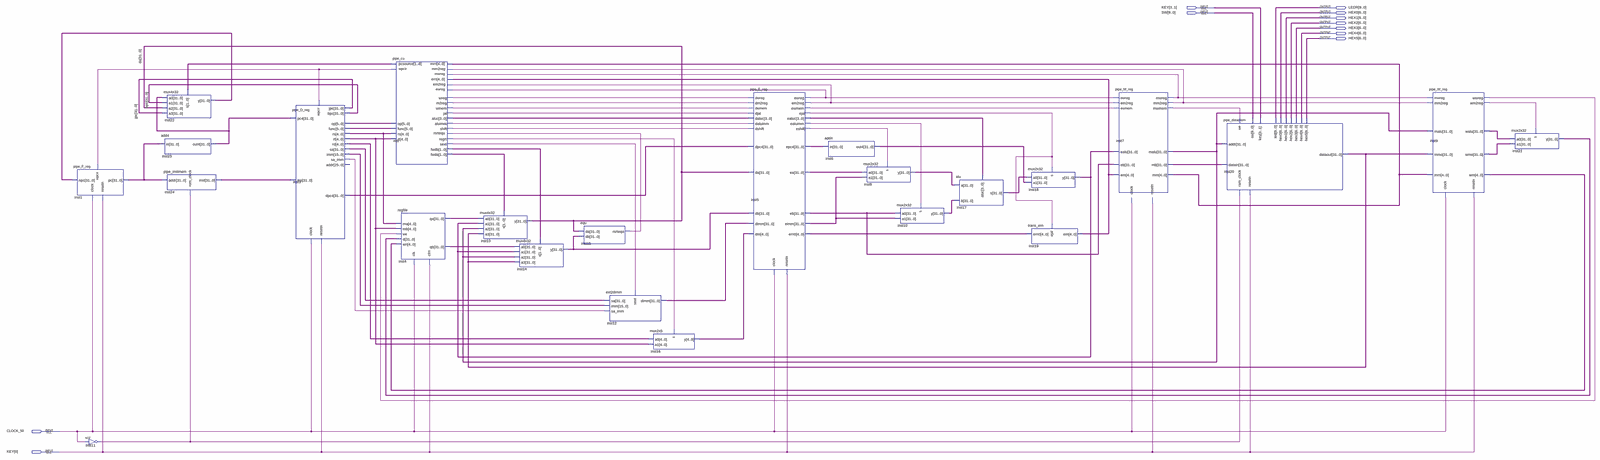
[diagram p0: schematic sheet, whole]
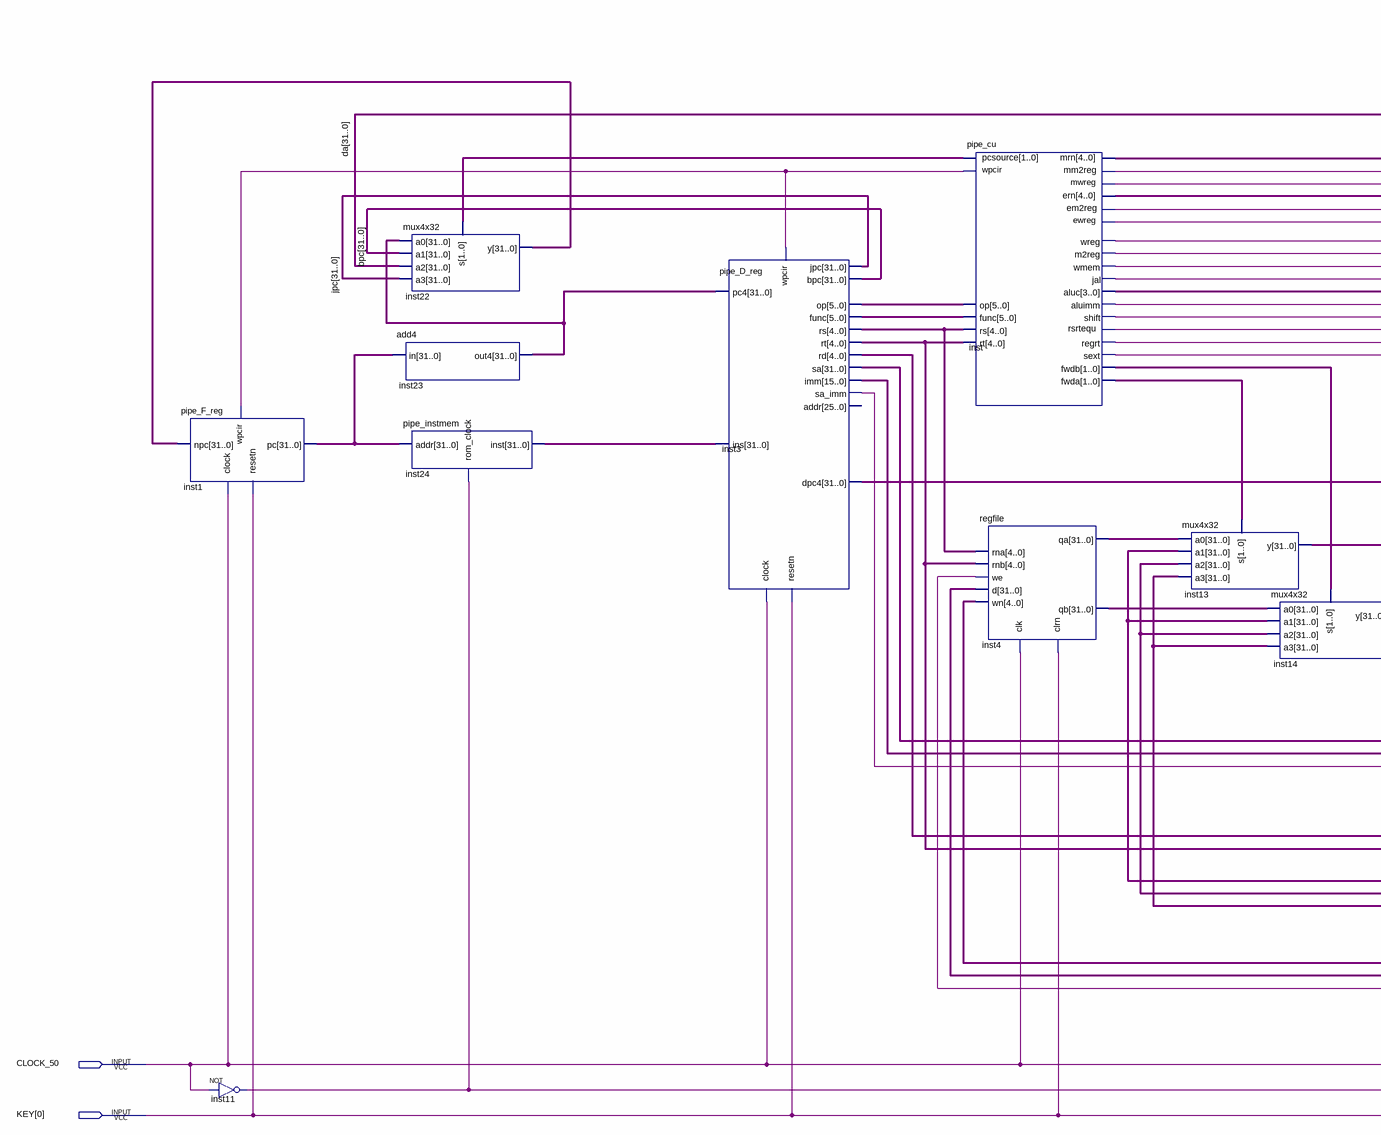
[diagram p1: schematic sheet, left part]
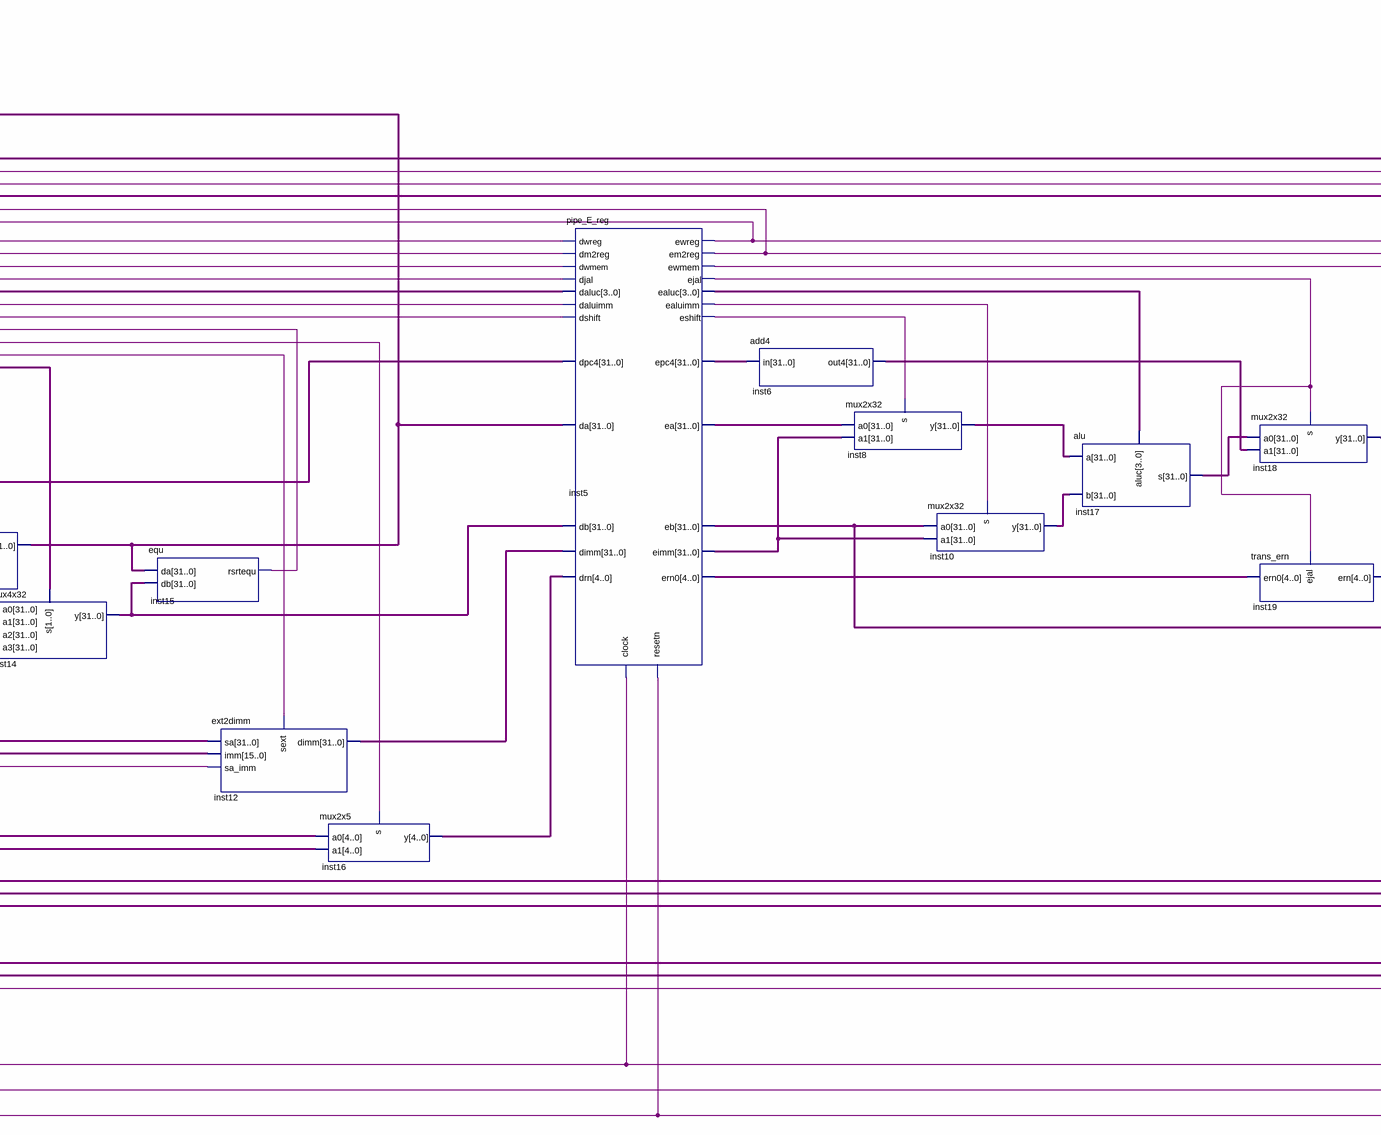
[diagram p2: schematic sheet, centre part]
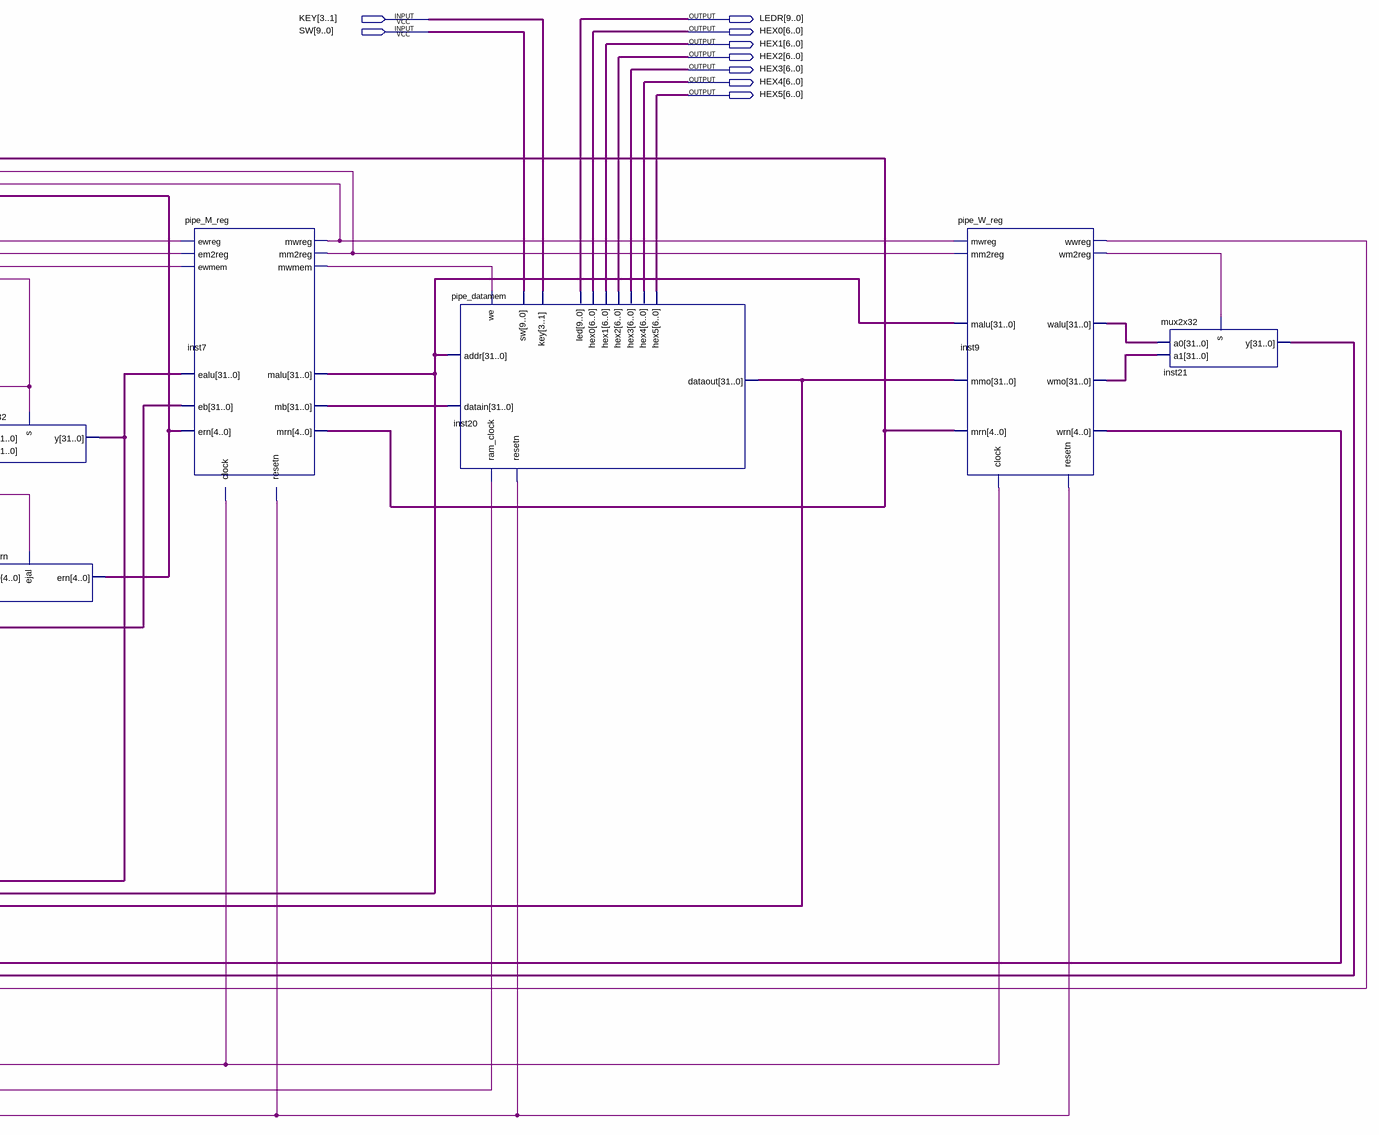
[diagram p3: schematic sheet, right part]
// Quartus schematic pipe_computer.bdf as structural Verilog: 24 symbols, 11 pins
module pipe_computer (
  input  [3:0] KEY,
  input  [9:0] SW,
  input  CLOCK_50,
  output [9:0] LEDR,
  output [6:0] HEX0,
  output [6:0] HEX1,
  output [6:0] HEX2,
  output [6:0] HEX3,
  output [6:0] HEX4,
  output [6:0] HEX5
);

  wire inst3_sa_imm, inst5_ealuimm, inst5_ejal, inst5_em2reg, inst5_eshift, inst5_ewmem, inst5_ewreg,
       inst7_mm2reg, inst7_mwmem, inst7_mwreg, inst9_wm2reg, inst9_wwreg, inst11_out, inst15_rsrtequ,
       inst_aluimm, inst_jal, inst_m2reg, inst_regrt, inst_sext, inst_shift, inst_wmem, inst_wpcir, inst_wreg;
  wire [1:0] inst_fwda, inst_fwdb, inst_pcsource;
  wire [3:0] inst5_ealuc, inst_aluc;
  wire [4:0] inst3_rd, inst3_rs, inst3_rt, inst5_ern0, inst7_mrn, inst9_wrn, inst16_y, inst19_ern;
  wire [5:0] inst3_func, inst3_op;
  wire [15:0] inst3_imm;
  wire [31:0] bpc, da, inst1_pc, inst3_dpc4, inst3_sa, inst4_qa, inst4_qb, inst5_ea, inst5_eb, inst5_eimm,
       inst5_epc4, inst6_out4, inst7_malu, inst7_mb, inst8_y, inst9_walu, inst9_wmo, inst10_y, inst12_dimm,
       inst14_y, inst17_s, inst18_y, inst20_dataout, inst21_y, inst22_y, inst23_out4, inst24_inst, jpc;

  pipe_F_reg inst1 (.npc(inst22_y), .wpcir(inst_wpcir), .clock(CLOCK_50), .resetn(KEY[0]), .pc(inst1_pc));
  not inst11 (inst11_out, CLOCK_50);
  mux4x32 inst22 (.a0(inst23_out4), .a1(bpc), .a2(da), .a3(jpc), .s(inst_pcsource), .y(inst22_y));
  add4 inst23 (.in(inst1_pc), .out4(inst23_out4));
  pipe_instmem inst24 (.addr(inst1_pc), .rom_clock(inst11_out), .inst(inst24_inst));
  pipe_D_reg inst3 (
    .pc4(inst23_out4), .ins(inst24_inst), .wpcir(inst_wpcir), .clock(CLOCK_50), .resetn(KEY[0]),
    .dpc4(inst3_dpc4), .op(inst3_op), .func(inst3_func), .rs(inst3_rs), .rt(inst3_rt), .rd(inst3_rd),
    .sa(inst3_sa), .imm(inst3_imm), .sa_imm(inst3_sa_imm), .jpc(jpc), .bpc(bpc));  // open: addr
  pipe_cu inst (
    .op(inst3_op), .func(inst3_func), .rs(inst3_rs), .rt(inst3_rt), .ern(inst19_ern), .mrn(inst7_mrn),
    .rsrtequ(inst15_rsrtequ), .ewreg(inst5_ewreg), .em2reg(inst5_em2reg), .mwreg(inst7_mwreg),
    .mm2reg(inst7_mm2reg), .wpcir(inst_wpcir), .wreg(inst_wreg), .m2reg(inst_m2reg), .wmem(inst_wmem),
    .jal(inst_jal), .aluimm(inst_aluimm), .shift(inst_shift), .regrt(inst_regrt), .sext(inst_sext),
    .pcsource(inst_pcsource), .fwda(inst_fwda), .fwdb(inst_fwdb), .aluc(inst_aluc));
  regfile inst4 (
    .rna(inst3_rs), .rnb(inst3_rt), .d(inst21_y), .wn(inst9_wrn), .we(inst9_wwreg), .clk(CLOCK_50),
    .clrn(KEY[0]), .qa(inst4_qa), .qb(inst4_qb));
  mux4x32 inst13 (.a0(inst4_qa), .a1(inst18_y), .a2(inst7_malu), .a3(inst20_dataout), .s(inst_fwda), .y(da));
  mux4x32 inst14 (.a0(inst4_qb), .a1(inst18_y), .a2(inst7_malu), .a3(inst20_dataout), .s(inst_fwdb), .y(inst14_y));
  equ inst15 (.da(da), .db(inst14_y), .rsrtequ(inst15_rsrtequ));
  ext2dimm inst12 (.sa(inst3_sa), .imm(inst3_imm), .sa_imm(inst3_sa_imm), .sext(inst_sext), .dimm(inst12_dimm));
  mux2x5 inst16 (.a0(inst3_rd), .a1(inst3_rt), .s(inst_regrt), .y(inst16_y));
  pipe_E_reg inst5 (
    .dwreg(inst_wreg), .dm2reg(inst_m2reg), .dwmem(inst_wmem), .daluc(inst_aluc), .daluimm(inst_aluimm),
    .da(da), .db(inst14_y), .dimm(inst12_dimm), .drn(inst16_y), .dshift(inst_shift), .djal(inst_jal),
    .dpc4(inst3_dpc4), .clock(CLOCK_50), .resetn(KEY[0]), .ewreg(inst5_ewreg), .em2reg(inst5_em2reg),
    .ewmem(inst5_ewmem), .ealuc(inst5_ealuc), .ealuimm(inst5_ealuimm), .ea(inst5_ea), .eb(inst5_eb),
    .eimm(inst5_eimm), .ern0(inst5_ern0), .eshift(inst5_eshift), .ejal(inst5_ejal), .epc4(inst5_epc4));
  add4 inst6 (.in(inst5_epc4), .out4(inst6_out4));
  mux2x32 inst8 (.a0(inst5_ea), .a1(inst5_eimm), .s(inst5_eshift), .y(inst8_y));
  mux2x32 inst10 (.a0(inst5_eb), .a1(inst5_eimm), .s(inst5_ealuimm), .y(inst10_y));
  alu inst17 (.a(inst8_y), .b(inst10_y), .aluc(inst5_ealuc), .s(inst17_s));
  mux2x32 inst18 (.a0(inst17_s), .a1(inst6_out4), .s(inst5_ejal), .y(inst18_y));
  trans_ern inst19 (.ern0(inst5_ern0), .ejal(inst5_ejal), .ern(inst19_ern));
  pipe_M_reg inst7 (
    .ewreg(inst5_ewreg), .em2reg(inst5_em2reg), .ewmem(inst5_ewmem), .ealu(inst18_y), .eb(inst5_eb),
    .ern(inst19_ern), .clock(CLOCK_50), .resetn(KEY[0]), .mwreg(inst7_mwreg), .mm2reg(inst7_mm2reg),
    .mwmem(inst7_mwmem), .malu(inst7_malu), .mb(inst7_mb), .mrn(inst7_mrn));
  pipe_datamem inst20 (
    .addr(inst7_malu), .datain(inst7_mb), .we(inst7_mwmem), .ram_clock(inst11_out), .resetn(KEY[0]), .sw(SW),
    .key(KEY[3:1]), .dataout(inst20_dataout), .hex5(HEX5), .hex4(HEX4), .hex3(HEX3), .hex2(HEX2),
    .hex1(HEX1), .hex0(HEX0), .led(LEDR));
  pipe_W_reg inst9 (
    .mwreg(inst7_mwreg), .mm2reg(inst7_mm2reg), .mmo(inst20_dataout), .malu(inst7_malu), .mrn(inst7_mrn),
    .clock(CLOCK_50), .resetn(KEY[0]), .wwreg(inst9_wwreg), .wm2reg(inst9_wm2reg), .wmo(inst9_wmo),
    .walu(inst9_walu), .wrn(inst9_wrn));
  mux2x32 inst21 (.a0(inst9_walu), .a1(inst9_wmo), .s(inst9_wm2reg), .y(inst21_y));
endmodule
